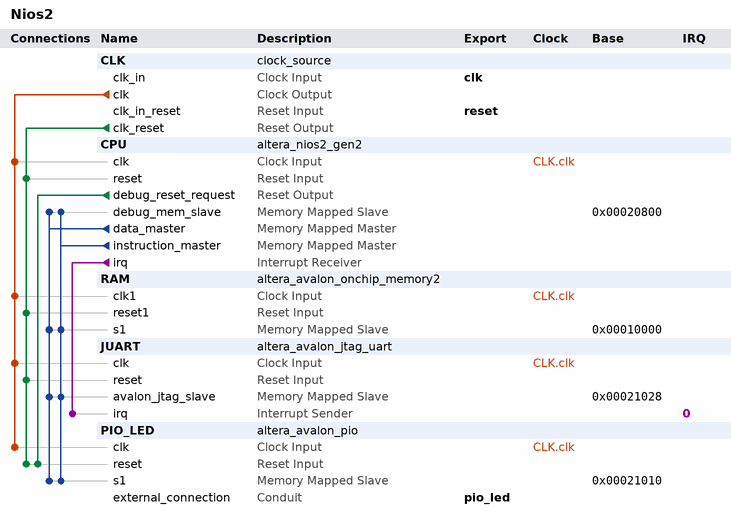
[diagram p0: system contents]
# Platform Designer (Qsys) system Nios2, Cyclone V 5CSXFC6D6F31C6
# Parameters at their usual value, and those the tool derives, are not listed.
package require -exact qsys 18.1
create_system Nios2
set_project_property DEVICE_FAMILY {Cyclone V}
set_project_property DEVICE 5CSXFC6D6F31C6

add_instance CLK clock_source 18.1
set_instance_parameter_value CLK clockFrequency 50000000

add_instance CPU altera_nios2_gen2 18.1
set_instance_parameter_value CPU dcache_size 2048
set_instance_parameter_value CPU exceptionSlave RAM.s1
set_instance_parameter_value CPU icache_size 4096
set_instance_parameter_value CPU impl Tiny
set_instance_parameter_value CPU resetSlave RAM.s1
set_instance_parameter_value CPU setting_activateTrace true

add_instance RAM altera_avalon_onchip_memory2 18.1
set_instance_parameter_value RAM dataWidth 32
set_instance_parameter_value RAM dualPort false
set_instance_parameter_value RAM initMemContent true
set_instance_parameter_value RAM initializationFileName onchip_mem.hex
set_instance_parameter_value RAM memorySize 40960

add_instance JUART altera_avalon_jtag_uart 18.1
set_instance_parameter_value JUART simInteractiveOptions NO_INTERACTIVE_WINDOWS

add_instance PIO_LED altera_avalon_pio 18.1
set_instance_parameter_value PIO_LED direction Output
set_instance_parameter_value PIO_LED width 10

# connections
add_connection CLK.clk CPU.clk clock
add_connection CLK.clk JUART.clk clock
add_connection CLK.clk PIO_LED.clk clock
add_connection CLK.clk RAM.clk1 clock
add_connection CLK.clk_reset CPU.reset reset
add_connection CLK.clk_reset JUART.reset reset
add_connection CLK.clk_reset PIO_LED.reset reset
add_connection CLK.clk_reset RAM.reset1 reset
add_connection CPU.debug_reset_request PIO_LED.reset reset
add_connection CPU.data_master CPU.debug_mem_slave avalon
set_connection_parameter_value CPU.data_master/CPU.debug_mem_slave baseAddress 0x00020800
add_connection CPU.data_master JUART.avalon_jtag_slave avalon
set_connection_parameter_value CPU.data_master/JUART.avalon_jtag_slave baseAddress 0x00021028
add_connection CPU.data_master PIO_LED.s1 avalon
set_connection_parameter_value CPU.data_master/PIO_LED.s1 baseAddress 0x00021010
add_connection CPU.data_master RAM.s1 avalon
set_connection_parameter_value CPU.data_master/RAM.s1 baseAddress 0x00010000
add_connection CPU.instruction_master CPU.debug_mem_slave avalon
set_connection_parameter_value CPU.instruction_master/CPU.debug_mem_slave baseAddress 0x00020800
add_connection CPU.instruction_master JUART.avalon_jtag_slave avalon
set_connection_parameter_value CPU.instruction_master/JUART.avalon_jtag_slave baseAddress 0x00021028
add_connection CPU.instruction_master PIO_LED.s1 avalon
set_connection_parameter_value CPU.instruction_master/PIO_LED.s1 baseAddress 0x00021010
add_connection CPU.instruction_master RAM.s1 avalon
set_connection_parameter_value CPU.instruction_master/RAM.s1 baseAddress 0x00010000
add_connection CPU.irq JUART.irq interrupt
set_connection_parameter_value CPU.irq/JUART.irq irqNumber 0

# exported interfaces
add_interface clk clock sink
set_interface_property clk EXPORT_OF CLK.clk_in
add_interface pio_led conduit end
set_interface_property pio_led EXPORT_OF PIO_LED.external_connection
add_interface reset reset sink
set_interface_property reset EXPORT_OF CLK.clk_in_reset

set_interconnect_requirement {$system} qsys_mm.clockCrossingAdapter HANDSHAKE
set_interconnect_requirement {$system} qsys_mm.maxAdditionalLatency 1

save_system Nios2.qsys
